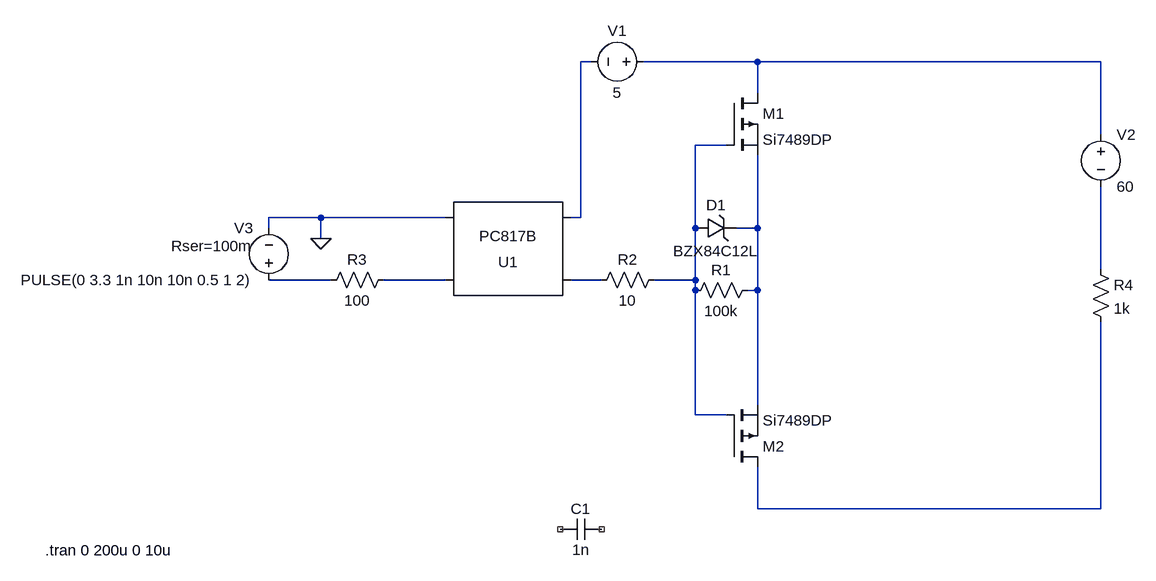
[diagram p0: schematic Draft1.asc]
Draft1.asc, the LTspice schematic file:
Version 4.1
SHEET 1 1224 680
WIRE 384 -416 368 -416
WIRE 640 -416 464 -416
WIRE 1168 -416 640 -416
WIRE 640 -368 640 -416
WIRE 1168 -304 1168 -416
WIRE 592 -288 544 -288
WIRE -32 -176 -112 -176
WIRE 160 -176 -32 -176
WIRE 368 -176 368 -416
WIRE 368 -176 352 -176
WIRE -112 -160 -112 -176
WIRE 544 -160 544 -288
WIRE 640 -160 640 -272
WIRE 640 -160 608 -160
WIRE -32 -144 -32 -176
WIRE 1168 -96 1168 -224
WIRE -16 -80 -112 -80
WIRE 160 -80 64 -80
WIRE 400 -80 352 -80
WIRE 544 -80 544 -160
WIRE 544 -80 480 -80
WIRE 544 -64 544 -80
WIRE 640 -64 640 -160
WIRE 640 -64 624 -64
WIRE 640 112 640 -64
WIRE 544 128 544 -64
WIRE 592 128 544 128
WIRE 640 272 640 208
WIRE 1168 272 1168 -16
WIRE 1168 272 640 272
FLAG -32 -144 0
SYMBOL res 640 -80 R90
WINDOW 0 0 56 VBottom 2
WINDOW 3 32 56 VTop 2
SYMATTR InstName R1
SYMATTR Value 100k
SYMBOL zener 544 -144 R270
WINDOW 0 36 32 VTop 2
WINDOW 3 -4 32 VBottom 2
SYMATTR InstName D1
SYMATTR Value BZX84C12L
SYMBOL cap 400 288 R90
WINDOW 0 0 32 VBottom 2
WINDOW 3 32 32 VTop 2
SYMATTR InstName C1
SYMATTR Value 1n
SYMBOL voltage 480 -416 R90
WINDOW 0 -32 56 VBottom 2
WINDOW 3 32 56 VTop 2
WINDOW 123 0 0 Left 0
WINDOW 39 0 0 Left 0
SYMATTR InstName V1
SYMATTR Value 5
SYMBOL Optos\\PC817B 256 -128 M180
SYMATTR InstName U1
SYMBOL res 496 -96 R90
WINDOW 0 0 56 VBottom 2
WINDOW 3 32 56 VTop 2
SYMATTR InstName R2
SYMATTR Value 10
SYMBOL voltage 1168 -320 R0
WINDOW 123 0 0 Left 0
WINDOW 39 0 0 Left 0
SYMATTR InstName V2
SYMATTR Value 60
SYMBOL voltage -112 -64 R180
WINDOW 0 24 96 Left 2
WINDOW 3 24 16 Left 2
WINDOW 123 0 0 Left 0
WINDOW 39 24 68 Left 2
SYMATTR InstName V3
SYMATTR Value PULSE(0 3.3 1n 10n 10n 0.5 1 2)
SYMATTR SpiceLine Rser=100m
SYMBOL res 80 -96 R90
WINDOW 0 0 56 VBottom 2
WINDOW 3 32 56 VTop 2
SYMATTR InstName R3
SYMATTR Value 100
SYMBOL res 1152 -112 R0
SYMATTR InstName R4
SYMATTR Value 1k
SYMBOL pmos 592 -368 R0
SYMATTR InstName M1
SYMATTR Value Si7489DP
SYMBOL pmos 592 208 M180
SYMATTR InstName M2
SYMATTR Value Si7489DP
TEXT -456 336 Left 2 !.tran 0 200u 0 10u

The netlist it stands for:
* Draft1.asc
R1 N004 N003 100k
D1 N003 N004 BZX84C12L
C1 NC_01 NC_02 1n
V1 N002 N001 5
X§U1 N007 0 N008 N001 PC817 Igain=1.5m
R2 N003 N008 10
V2 N002 N005 60
V3 N006 0 PULSE(0 3.3 1n 10n 10n 0.5 1 2) Rser=100m
R3 N007 N006 100
R4 N005 N009 1k
M1 N002 N003 N004 N004 Si7489DP
M2 N009 N003 N004 N004 Si7489DP
.model D D
.lib standard.dio
.model NMOS NMOS
.model PMOS PMOS
.lib standard.mos
.tran 0 200u 0 10u
.lib PC817.sub
.backanno
.end